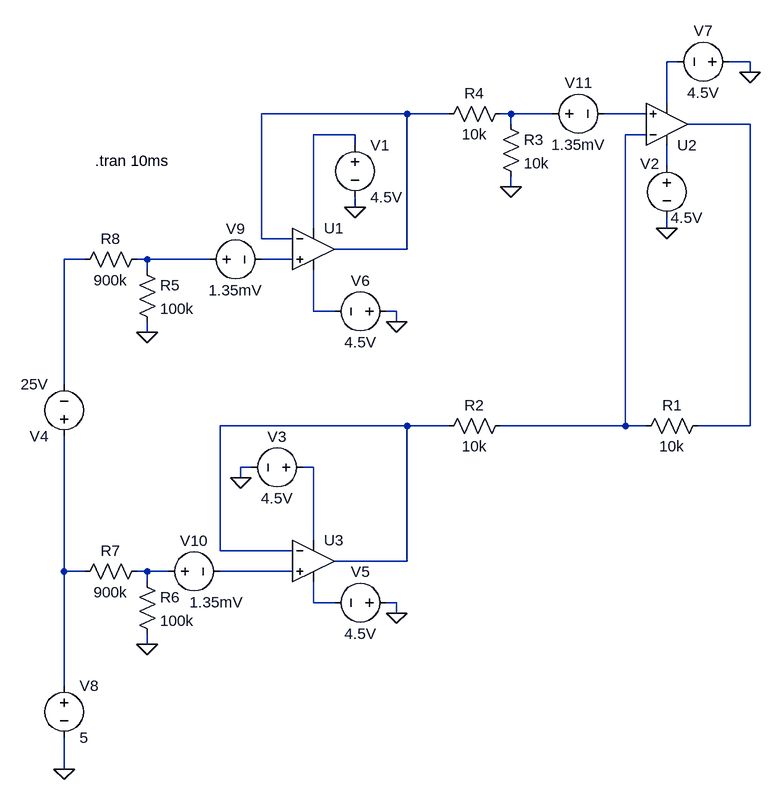
[diagram p0: schematic diff_stage.asc]
diff_stage.asc, the LTspice schematic file:
Version 4
SHEET 1 884 1236
WIRE 752 128 736 128
WIRE 864 128 832 128
WIRE 864 144 864 128
WIRE 736 192 736 128
WIRE 336 208 112 208
WIRE 400 208 336 208
WIRE 496 208 480 208
WIRE 560 208 496 208
WIRE 704 208 640 208
WIRE 496 224 496 208
WIRE 864 224 768 224
WIRE 256 240 192 240
WIRE 704 240 672 240
WIRE 256 256 256 240
WIRE 736 288 736 256
WIRE 496 320 496 304
WIRE 256 352 256 336
WIRE 192 384 192 240
WIRE 736 384 736 368
WIRE 112 400 112 208
WIRE 160 400 112 400
WIRE 336 416 336 208
WIRE 336 416 224 416
WIRE -160 432 -192 432
WIRE -64 432 -80 432
WIRE 32 432 -64 432
WIRE 160 432 112 432
WIRE -64 448 -64 432
WIRE 192 512 192 448
WIRE 224 512 192 512
WIRE 320 512 304 512
WIRE 320 528 320 512
WIRE -64 544 -64 528
WIRE -192 624 -192 432
WIRE 336 688 48 688
WIRE 400 688 336 688
WIRE 672 688 672 240
WIRE 672 688 480 688
WIRE 704 688 672 688
WIRE 864 688 864 224
WIRE 864 688 784 688
WIRE 96 752 80 752
WIRE 192 752 176 752
WIRE 80 768 80 752
WIRE 192 864 192 752
WIRE 48 880 48 688
WIRE 160 880 48 880
WIRE 336 896 336 688
WIRE 336 896 224 896
WIRE -192 912 -192 704
WIRE -160 912 -192 912
WIRE -64 912 -80 912
WIRE -32 912 -64 912
WIRE 160 912 48 912
WIRE -64 928 -64 912
WIRE 192 960 192 928
WIRE 224 960 192 960
WIRE 320 960 304 960
WIRE 320 976 320 960
WIRE -64 1024 -64 1008
WIRE -192 1088 -192 912
WIRE -192 1216 -192 1168
FLAG 256 352 0
FLAG 496 320 0
FLAG -64 544 0
FLAG -64 1024 0
FLAG 80 768 0
FLAG 320 976 0
FLAG 320 528 0
FLAG 864 144 0
FLAG 736 384 0
FLAG -192 1216 0
SYMBOL Opamps\\UniversalOpAmp 192 416 R0
SYMATTR InstName U1
SYMBOL voltage 256 240 R0
SYMATTR InstName V1
SYMATTR Value 4.5V
SYMBOL Opamps\\UniversalOpAmp 736 224 M180
SYMATTR InstName U2
SYMBOL Opamps\\UniversalOpAmp 192 896 R0
SYMATTR InstName U3
SYMBOL voltage 192 752 R90
WINDOW 0 -32 56 VBottom 2
WINDOW 3 32 56 VTop 2
SYMATTR InstName V3
SYMATTR Value 4.5V
SYMBOL res 800 672 R90
WINDOW 0 0 56 VBottom 2
WINDOW 3 32 56 VTop 2
SYMATTR InstName R1
SYMATTR Value 10k
SYMBOL res 496 672 R90
WINDOW 0 0 56 VBottom 2
WINDOW 3 32 56 VTop 2
SYMATTR InstName R2
SYMATTR Value 10k
SYMBOL res 480 208 R0
SYMATTR InstName R3
SYMATTR Value 10k
SYMBOL res 496 192 R90
WINDOW 0 0 56 VBottom 2
WINDOW 3 32 56 VTop 2
SYMATTR InstName R4
SYMATTR Value 10k
SYMBOL voltage 736 272 R0
WINDOW 0 -41 13 Left 2
WINDOW 3 6 96 Left 2
SYMATTR InstName V2
SYMATTR Value 4.5V
SYMBOL res -80 432 R0
SYMATTR InstName R5
SYMATTR Value 100k
SYMBOL res -80 912 R0
SYMATTR InstName R6
SYMATTR Value 100k
SYMBOL res -64 896 R90
WINDOW 0 0 56 VBottom 2
WINDOW 3 32 56 VTop 2
SYMATTR InstName R7
SYMATTR Value 900k
SYMBOL res -64 416 R90
WINDOW 0 0 56 VBottom 2
WINDOW 3 32 56 VTop 2
SYMATTR InstName R8
SYMATTR Value 900k
SYMBOL voltage -192 720 R180
WINDOW 123 0 0 Left 0
WINDOW 39 0 0 Left 0
SYMATTR InstName V4
SYMATTR Value 25V
SYMBOL voltage 320 960 R90
WINDOW 0 -32 56 VBottom 2
WINDOW 3 32 56 VTop 2
SYMATTR InstName V5
SYMATTR Value 4.5V
SYMBOL voltage 320 512 R90
WINDOW 0 -32 56 VBottom 2
WINDOW 3 32 56 VTop 2
SYMATTR InstName V6
SYMATTR Value 4.5V
SYMBOL voltage 848 128 R90
WINDOW 0 -32 56 VBottom 2
WINDOW 3 32 56 VTop 2
SYMATTR InstName V7
SYMATTR Value 4.5V
SYMBOL voltage -192 1072 R0
WINDOW 123 0 0 Left 0
WINDOW 39 0 0 Left 0
SYMATTR InstName V8
SYMATTR Value 5
SYMBOL voltage 16 432 R270
WINDOW 0 32 56 VTop 2
WINDOW 3 -32 56 VBottom 2
SYMATTR InstName V9
SYMATTR Value 1.35mV
SYMBOL voltage -48 912 R270
WINDOW 0 32 56 VTop 2
WINDOW 3 -32 91 VBottom 2
SYMATTR InstName V10
SYMATTR Value 1.35mV
SYMBOL voltage 544 208 R270
WINDOW 0 32 56 VTop 2
WINDOW 3 -32 56 VBottom 2
SYMATTR InstName V11
SYMATTR Value 1.35mV
TEXT -144 280 Left 2 !.tran 10ms

The netlist it stands for:
* diff_stage.asc
XU1 N011 N002 N006 N012 N002 level1 Avol=1Meg GBW=10Meg Vos=0 En=0 Enk=0 In=0 Ink=0 Rin=500Meg  ; pins In+ In- V+ V- OUT
V1 N006 0 4.5V
XU2 N004 N007 N008 N001 N005 level1 Avol=1Meg GBW=10Meg Vos=0 En=0 Enk=0 In=0 Ink=0 Rin=500Meg  ; pins In+ In- V+ V- OUT
XU3 N017 N013 N014 N018 N013 level1 Avol=1Meg GBW=10Meg Vos=0 En=0 Enk=0 In=0 Ink=0 Rin=500Meg  ; pins In+ In- V+ V- OUT
V3 N014 0 4.5V
R1 N005 N007 10k
R2 N007 N013 10k
R3 N003 0 10k
R4 N003 N002 10k
V2 N008 0 4.5V
R5 N010 0 100k
R6 N016 0 100k
R7 N016 N015 900k
R8 N010 N009 900k
V4 N015 N009 25V
V5 0 N018 4.5V
V6 0 N012 4.5V
V7 0 N001 4.5V
V8 N015 0 5
V9 N010 N011 1.35mV
V10 N016 N017 1.35mV
V11 N003 N004 1.35mV
.tran 10ms
.lib UniversalOpAmp1.lib
.backanno
.end